# EAGLE design knitic v2.1 (EAGLE 7.2.0)
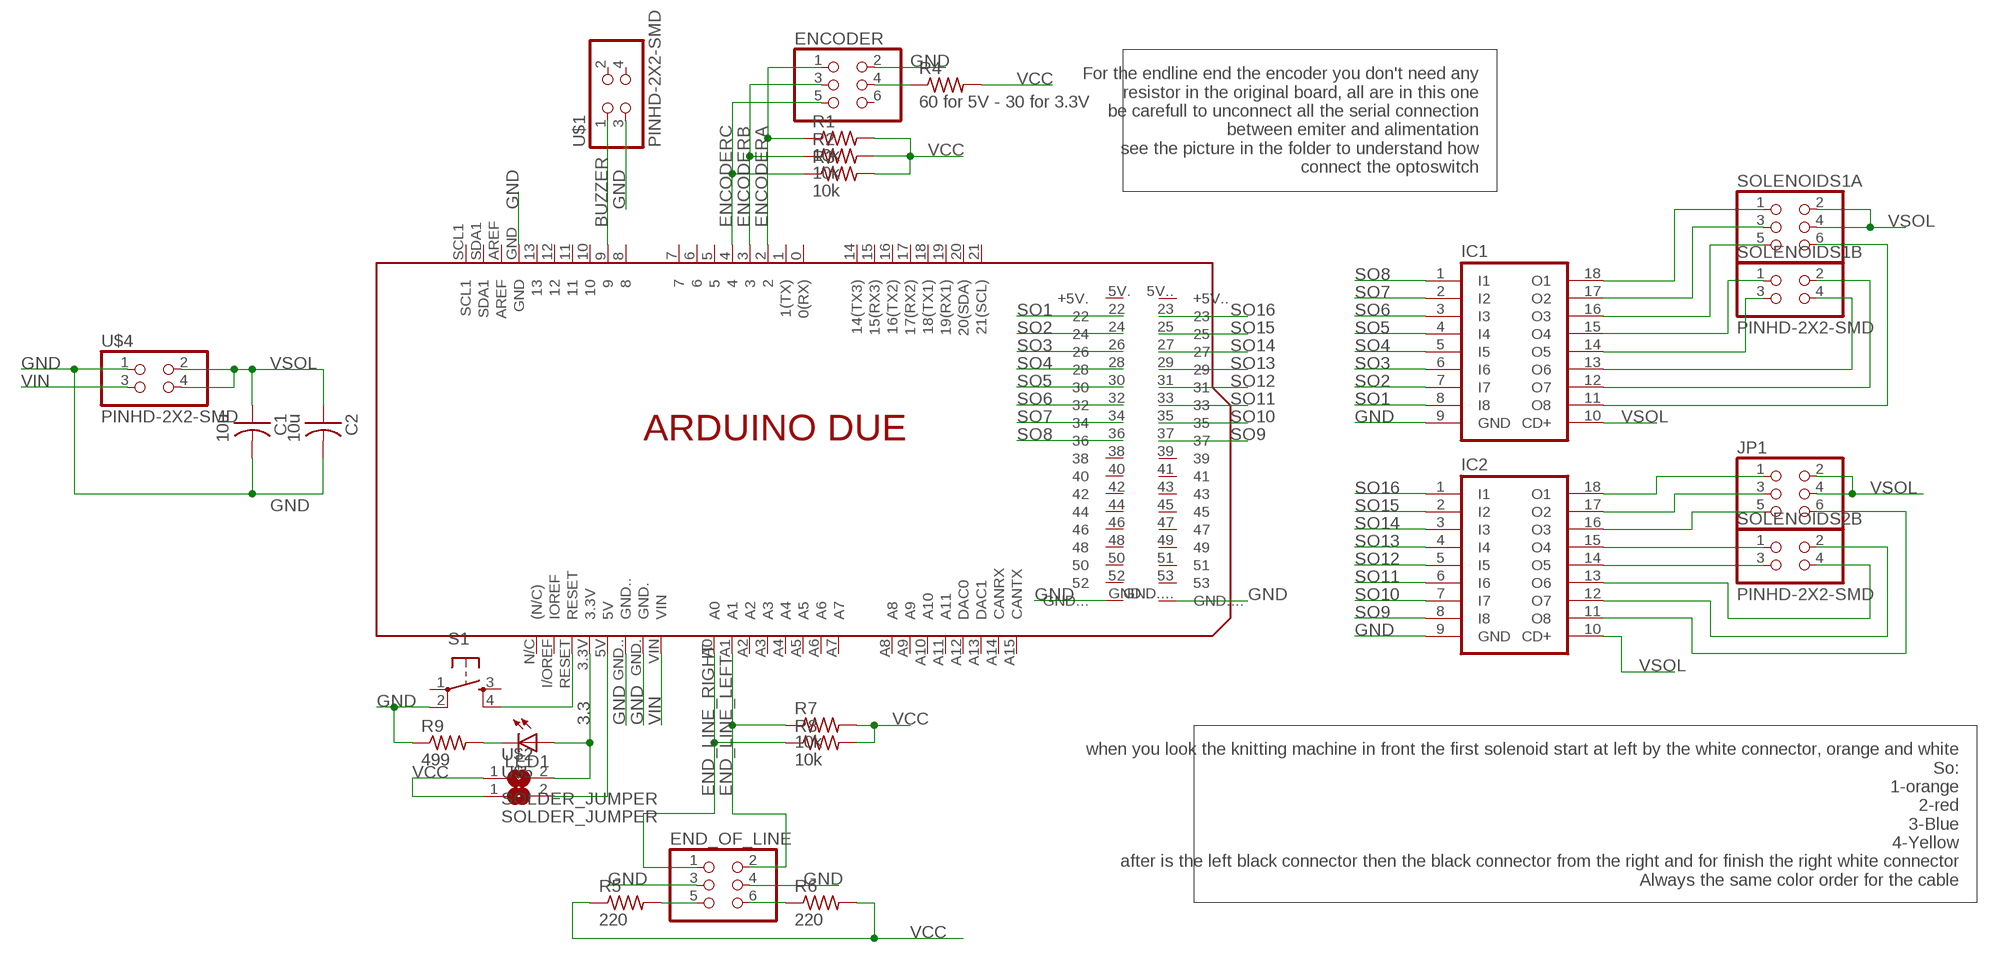
[diagram p0: schematic, sheet 1]

## Parts
C1  10u  CAP-US1206FAB  [C1206FAB]
C2  10u  CAP-US1206FAB  [C1206FAB]
ENCODER  PINHD-2X3-SMD  [2X03SMD]
END_OF_LINE  PINHD-2X3-SMD  [2X03SMD]
IC1  ULN2803ASO  [SO18W]
IC2  ULN2803ASO  [SO18W]
JP1  PINHD-2X3-SMD  [2X03SMD]
LED1  LEDSMT1206  [1206]
PCB1  ARDUINO_DUE_MIN  [ARDUINO_DUE_MIN]
R1  10k  RES-US1206FAB  [R1206FAB]
R2  10k  RES-US1206FAB  [R1206FAB]
R3  10k  RES-US1206FAB  [R1206FAB]
R4  60 for 5V - 30 for 3.3V  RES-US1206FAB  [R1206FAB]
R5  220  RES-US1206FAB  [R1206FAB]
R6  220  RES-US1206FAB  [R1206FAB]
R7  10k  RES-US1206FAB  [R1206FAB]
R8  10k  RES-US1206FAB  [R1206FAB]
R9  499  RES-US1206FAB  [R1206FAB]
S1  6MM_SWITCH6MM_SWITCH  [6MM_SWITCH]
SOLENOIDS1A  PINHD-2X3-SMD  [2X03SMD]
SOLENOIDS1B  PINHD-2X2-SMD  [2X02SMD]
SOLENOIDS2B  PINHD-2X2-SMD  [2X02SMD]
U$1  PINHD-2X2-SMD  [2X02SMD]
U$2  SOLDER_JUMPER  [SJFAB]
U$4  PINHD-2X2-SMD  [2X02SMD]
U$5  SOLDER_JUMPER  [SJFAB]

## Nets
3.3: LED1.A PCB1.3.3V U$2.2
BUZZER: PCB1.9 U$1.1
ENCODERA: ENCODER.1 PCB1.2 R1.1
ENCODERB: ENCODER.3 PCB1.3 R2.1
ENCODERC: ENCODER.5 PCB1.4 R3.1
END_LINE_LEFT: END_OF_LINE.2 PCB1.A1 R7.1
END_LINE_RIGHT: END_OF_LINE.1 PCB1.A0 R8.1
GND: C1.2 C2.2 ENCODER.2 END_OF_LINE.3 END_OF_LINE.4 IC1.9(GND) IC2.9(GND) PCB1.GND PCB1.GND. PCB1.GND.. R9.1 S1.2(P1) U$1.3 U$4.1
N$1: ENCODER.4 R4.1
N$2: END_OF_LINE.5 R5.2
N$3: PCB1.RESET S1.4(S1)
N$4: IC1.18(O1) SOLENOIDS1A.1
N$5: END_OF_LINE.6 R6.1
N$6: LED1.C R9.2
N$7: IC1.17(O2) SOLENOIDS1A.3
N$8: IC1.16(O3) SOLENOIDS1A.5
N$9: IC1.15(O4) SOLENOIDS1B.1
N$10: IC1.14(O5) SOLENOIDS1B.3
N$11: IC1.13(O6) SOLENOIDS1B.4
N$12: IC1.12(O7) SOLENOIDS1B.2
N$13: IC1.11(O8) SOLENOIDS1A.6
N$14: IC2.18(O1) JP1.1
N$15: IC2.12(O7) SOLENOIDS2B.2
N$17: IC2.17(O2) JP1.3
N$18: IC2.16(O3) JP1.5
N$19: IC2.13(O6) SOLENOIDS2B.4
N$20: IC2.15(O4) SOLENOIDS2B.1
N$21: IC2.11(O8) JP1.6
N$23: PCB1.5V U$5.2
N$24: IC2.14(O5) SOLENOIDS2B.3
SO1: IC1.8(I8) PCB1.22
SO2: IC1.7(I7) PCB1.24
SO3: IC1.6(I6) PCB1.26
SO4: IC1.5(I5) PCB1.28
SO5: IC1.4(I4) PCB1.30
SO6: IC1.3(I3) PCB1.32
SO7: IC1.2(I2) PCB1.34
SO8: IC1.1(I1) PCB1.36
SO9: IC2.8(I8) PCB1.37
SO10: IC2.7(I7) PCB1.35
SO11: IC2.6(I6) PCB1.33
SO12: IC2.5(I5) PCB1.31
SO13: IC2.4(I4) PCB1.29
SO14: IC2.3(I3) PCB1.27
SO15: IC2.2(I2) PCB1.25
SO16: IC2.1(I1) PCB1.23
VCC: R1.2 R2.2 R3.2 R4.2 R5.1 R6.2 R7.2 R8.2 U$2.1 U$5.1
VIN: PCB1.VIN U$4.3
VSOL: C1.1 C2.1 IC1.10(CD+) IC2.10(CD+) JP1.2 JP1.4 SOLENOIDS1A.2 SOLENOIDS1A.4 U$4.2 U$4.4
Unconnected: ENCODER.6 PCB1.0(0(RX)) PCB1.1(1(TX)) PCB1.5 PCB1.5V.(+5V.) PCB1.5V..(+5V..) PCB1.6 PCB1.7 PCB1.8 PCB1.10 PCB1.11 PCB1.12 PCB1.13 PCB1.14(14(TX3)) PCB1.15(15(RX3)) PCB1.16(16(TX2)) PCB1.17(17(RX2)) PCB1.18(18(TX1)) PCB1.19(19(RX1)) PCB1.20(20(SDA)) PCB1.21(21(SCL)) PCB1.38 PCB1.39 PCB1.40 PCB1.41 PCB1.42 PCB1.43 PCB1.44 PCB1.45 PCB1.46 PCB1.47 PCB1.48 PCB1.49 PCB1.50 PCB1.51 PCB1.52 PCB1.53 PCB1.A2 PCB1.A3 PCB1.A4 PCB1.A5 PCB1.A6 PCB1.A7 PCB1.A8 PCB1.A9 PCB1.A10 PCB1.A11 PCB1.A12(DAC0) PCB1.A13(DAC1) PCB1.A14(CANRX) PCB1.A15(CANTX) PCB1.AREF PCB1.GND... PCB1.GND.... PCB1.I/OREF(IOREF) PCB1.N/C((N/C)) PCB1.SCL1 PCB1.SDA1 S1.1(P) S1.3(S) U$1.2 U$1.4

## Notes on the sheet
- For the endline end the encoder you don't need any
  resistor in the original board, all are in this one
  be carefull to unconnect all the serial connection
  between emiter and alimentation
  see the picture in the folder to understand how
  connect the optoswitch
- when you look the knitting machine in front the first solenoid start at left by the white connector, orange and white
  So:
  1-orange
  2-red
  3-Blue
  4-Yellow
  after is the left black connector then the black connector from the right and for finish the right white connector
  Always the same color order for the cable

## Library data of the parts
C1 C2 = fab:CAP-US
ENCODER END_OF_LINE JP1 SOLENOIDS1A = fab:PINHD-2X3-SMD: PIN HEADER
IC1 IC2 = zoilo:ULN2803A: DRIVER ARRAY
LED1 = adafruit:LED: LED OSRAM: - CHIPLED LG R971, LG N971, LY N971, LG Q971, LY Q971, LO R971, LY R971 LH N974, LH R974 LS Q976, LO Q976, LY Q976 LO Q996 - Hyper CHIPLED LW Q18S LB Q993, LB Q99A, LB R99A - SideLED LS A670, LO A670, LY A670, LG A670, LP A670 LB A673, LV A673, LT A673, LW A673 LH A674 LY A675 LS A676, LA A676, LO A676, LY A676, LW A676 LS A679, LY A679, LG A679 - Hyper Micro SIDELED® LS Y876, LA Y876, LO Y876, LY Y876 LT Y87S - SmartLED LW L88C, LW L88S LB L89C, LB L89S, LG L890 LS L89K, LO L89K, LY L89K LS L896, LA L896, LO L896, LY L896 - TOPLED LS T670, LO T670, LY T670, LG T670, LP T670 LSG T670, LSP T670, LSY T670, LOP T670, LYG T670 LG T671, LOG T671, LSG T671 LB T673, LV T673, LT T673, LW T673 LH T674 LS T676, LA T676, LO T676, LY T676, LB T676, LH T676, LSB T676, LW T676 LB T67C, LV T67C, LT T67C, LS T67K, LO T67K, LY T67K, LW E67C LS E67B, LA E67B, LO E67B, LY E67B, LB E67C, LV E67C, LT E67C LW T67C LS T679, LY T679, LG T679 LS T770, LO T770, LY T770, LG T770, LP T770 LB T773, LV T773, LT T773, LW T773 LH T774 LS E675, LA E675, LY E675, LS T675 LS T776, LA T776, LO T776, LY T776, LB T776 LHGB T686 LT T68C, LB T68C - Hyper Mini TOPLED® LB M676 - Mini TOPLED Santana® LG M470 LS M47K, LO M47K, LY M47K Source: http://www.osram.convergy.de/
PCB1 = E14_Arduino_revB:ARDUINO_DUE_MIN
R1-R9 = fab:RES-US: Resistor (US Symbol) Variants with postfix FAB are widened to allow the routing of internal traces
S1 = fab:6MM_SWITCH: OMRON SWITCH
SOLENOIDS1B SOLENOIDS2B U$1 U$4 = fab:PINHD-2X2-SMD
U$2 U$5 = fab:SOLDER_JUMPER

## Board
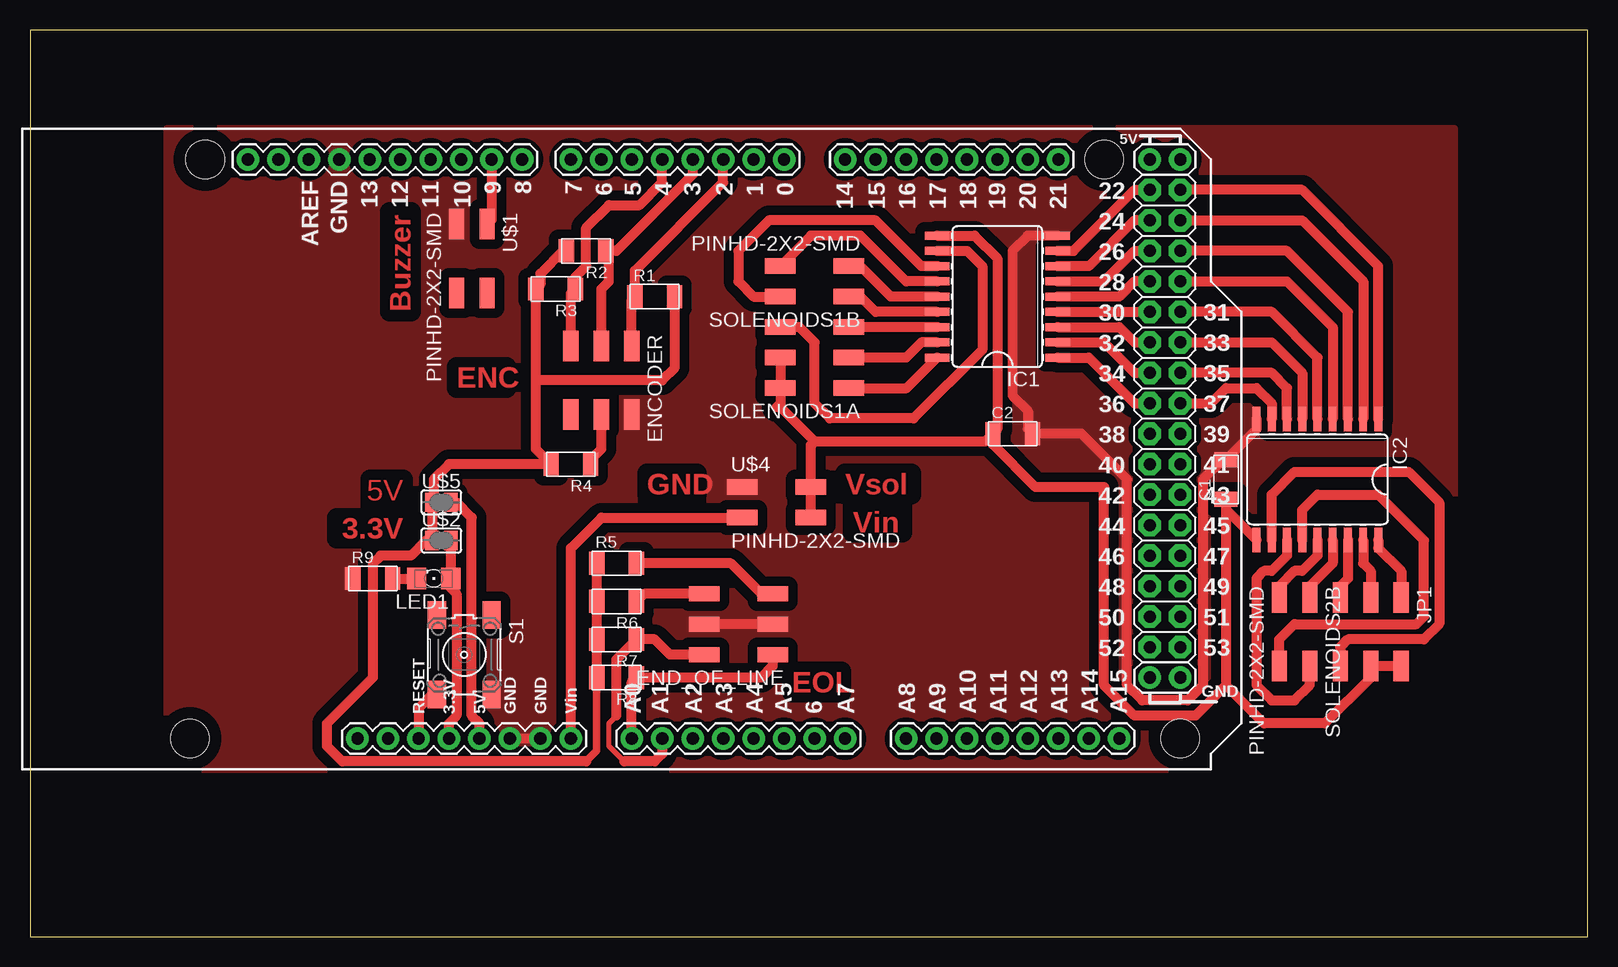
[diagram p1: board, top side]

Size 129.84 x 75.55 mm. Coordinates in mm from the lower left corner, seen from the top.
Outline: 0,0 129.84,0 129.84,75.55 0,75.55 0,0
Copper layers (1*16): Top 0.035mm / dielectric 1.5mm / Bottom 0.035mm
Design rules "fabmodule": minimum track width 10mil, minimum drill 0.4mm, track to track 0.42mm, track to pad 0.42mm, pad to pad 0.42mm, via to via 0.42mm, smd to smd 0.42mm, copper to edge 40mil, drill to drill 0.8mm, minimum pad ring 10mil, minimum via ring 8mil, stop-mask expansion 4mil, vias tented up to drill 0mil, thermal gap 10mil

### Footprints (pad centres in the part's own frame; a part is rotated, then mirrored left to right if it is on the bottom)
C1206FAB = smd 1.27 x 1.905: 1 -1.651,0; 2 1.651,0
2X03SMD = smd 2.54 x 1.27: 1 -2.857,2.54; 2 2.857,2.54; 3 -2.857,0; 4 2.857,0; 5 -2.857,-2.54; 6 2.857,-2.54
SO18W = smd 0.66 x 2.032: 1 -5.08,-5.029; 2 -3.81,-5.029; 3 -2.54,-5.029; 4 -1.27,-5.029; 5 0,-5.029; 6 1.27,-5.029; 7 2.54,-5.029; 8 3.81,-5.029; 9 5.08,-5.029; 10 5.08,5.029; 11 3.81,5.029; 12 2.54,5.029; 13 1.27,5.029; 14 0,5.029; 15 -1.27,5.029; 16 -2.54,5.029; 17 -3.81,5.029; 18 -5.08,5.029
1206 = smd 1.6 x 1.803: A -1.422,0; C 1.422,0
ARDUINO_DUE_MIN = drill 1.016 pad 1.88: 0 35.56,24.13; 1 33.02,24.13; 2 30.48,24.13; 3 27.94,24.13; 3.3V 7.62,-24.13; 4 25.4,24.13; 5 22.86,24.13; 5V 10.16,-24.13; 5V. 66.04,24.13; 5V.. 68.58,24.13; 6 20.32,24.13; 7 17.78,24.13; 8 13.716,24.13; 9 11.176,24.13; 10 8.636,24.13; 11 6.096,24.13; 12 3.556,24.13; 13 1.016,24.13; 14 40.64,24.13; 15 43.18,24.13; 16 45.72,24.13; 17 48.26,24.13; 18 50.8,24.13; 19 53.34,24.13; 20 55.88,24.13; 21 58.42,24.13; A0 22.86,-24.13; A1 25.4,-24.13; A2 27.94,-24.13; A3 30.48,-24.13; A4 33.02,-24.13; A5 35.56,-24.13; A6 38.1,-24.13; A7 40.64,-24.13; A8 45.72,-24.13; A9 48.26,-24.13; A10 50.8,-24.13; A11 53.34,-24.13; A12 55.88,-24.13; A13 58.42,-24.13; A14 60.96,-24.13; A15 63.5,-24.13; AREF -4.064,24.13; GND -1.524,24.13; GND. 15.24,-24.13; GND.. 12.7,-24.13; GND... 66.04,-19.05; GND.... 68.58,-19.05; I/OREF 2.54,-24.13; N/C 0,-24.13; RESET 5.08,-24.13; SCL1 -9.144,24.13; SDA1 -6.604,24.13; VIN 17.78,-24.13 | drill 1.016 pad 1.88 octagon: 22 66.04,21.59; 23 68.58,21.59; 24 66.04,19.05; 25 68.58,19.05; 26 66.04,16.51; 27 68.58,16.51; 28 66.04,13.97; 29 68.58,13.97; 30 66.04,11.43; 31 68.58,11.43; 32 66.04,8.89; 33 68.58,8.89; 34 66.04,6.35; 35 68.58,6.35; 36 66.04,3.81; 37 68.58,3.81; 38 66.04,1.27; 39 68.58,1.27; 40 66.04,-1.27; 41 68.58,-1.27; 42 66.04,-3.81; 43 68.58,-3.81; 44 66.04,-6.35; 45 68.58,-6.35; 46 66.04,-8.89; 47 68.58,-8.89; 48 66.04,-11.43; 49 68.58,-11.43; 50 66.04,-13.97; 51 68.58,-13.97; 52 66.04,-16.51; 53 68.58,-16.51 | hole 3.2: -12.7,24.13; -13.97,-24.13; 62.23,24.13; 68.58,-24.13
R1206FAB = smd 1.27 x 1.905: 1 -1.651,0; 2 1.651,0
6MM_SWITCH = smd 2.286 x 1.524: 1 -3.302,2.286; 2 3.302,2.286; 3 -3.302,-2.286; 4 3.302,-2.286
2X02SMD = smd 2.54 x 1.27: 1 -2.857,1.27; 2 2.857,1.27; 3 -2.857,-1.27; 4 2.857,-1.27
SJFAB = smd 1.118 x 1.6: 1 -0.787,0; 2 0.787,0

### Placement (x,y rotation side)
C1  99.69,38.1 90 top
C2  81.91,41.91 0 top
ENCODER  47.62,46.36 270 top
END_OF_LINE  59.05,26.04 180 top
IC1  80.65,53.34 90 top
IC2  107.31,38.1 180 top
JP1  111.76,25.4 270 top
LED1  33.66,29.84 180 top
PCB1  27.3,40.64 0 top
R1  52.07,53.34 0 top
R2  46.36,57.15 180 top
R3  43.81,53.97 180 top
R4  45.09,39.37 180 top
R5  48.9,31.11 0 top
R6  48.9,27.94 180 top
R7  48.9,24.77 180 top
R8  48.9,21.59 180 top
R9  28.58,29.84 0 top
S1  36.2,23.5 270 top
SOLENOIDS1A  65.41,48.26 180 top
SOLENOIDS1B  65.41,54.61 180 top
SOLENOIDS2B  105.41,25.4 270 top
U$1  36.83,56.52 270 top
U$2  34.29,33.02 0 top
U$4  62.23,36.2 0 top
U$5  34.29,36.2 0 top

### Tracks (layer width: path | path; a pad name or v marks a point on that pad's centre or on a via)
3.3
  Top 0.813: PCB1.3.3V 34.92,17.78 35.56,18.41 35.56,28.57 35.08,29.06 LED1.A | U$2.2 LED1.A | LED1.A
BUZZER
  Top 0.813: PCB1.9 38.48,59.75 U$1.1
ENCODERA
  Top 0.813: ENCODER.1 50.16,53.09 R1.1 50.42,55.5 57.79,62.86 PCB1.2
ENCODERB
  Top 0.813: PCB1.3 55.24,63.5 48.9,57.15 R2.1 48.26,56.9 48.26,54.61 47.62,53.97 ENCODER.3
ENCODERC
  Top 0.813: ENCODER.5 45.09,53.59 R3.1 45.47,54.99 46.36,55.88 46.36,59.06 48.26,60.96 50.8,60.96 52.7,62.86 PCB1.4
END_LINE_LEFT
  Top 0.406: 49.53,14.61 48.26,15.88 48.26,17.78 48.9,18.41
  Top 0.813: END_OF_LINE.2 53.34,23.5 52.07,24.77 R7.1 48.9,23.11 48.9,18.41 | PCB1.A1 52.7,15.24 52.07,14.61 49.53,14.61
END_LINE_RIGHT
  Top 0.813: PCB1.A0 50.16,21.21 R8.1 60.96,21.59 61.91,22.54 END_OF_LINE.1
GND
  Top 0.813: IC2.9 102.24,42.29 C1.2 99.44,39.75 97.79,38.1 97.79,20.95 96.52,19.69 92.71,19.69 91.44,20.95 91.44,38.1 87.63,41.91 C2.2 83.19,42.29 83.19,43.81 81.91,45.08 81.91,57.15 83.19,58.42 IC1.9 | END_OF_LINE.3 END_OF_LINE.4 | PCB1.GND. PCB1.GND..
  pour Top (isolate 0.813, no thermals): 11.43,67.31 118.75,67.31 118.75,13.97 11.43,13.97
N$1
  Top 0.813: R4.1 46.74,39.75 47.62,40.64 ENCODER.4
N$2
  Top 0.813: END_OF_LINE.5 60.96,28.57 58.42,31.11 R5.2
N$3
  Top 0.813: S1.4 33.53,20.19 32.39,19.05 PCB1.RESET
N$4
  Top 0.813: SOLENOIDS1A.1 73.08,45.72 IC1.18
N$5
  Top 0.813: END_OF_LINE.6 51.18,28.57 R6.1
N$6
  Top 0.813: R9.2 LED1.C
N$7
  Top 0.813: IC1.17 74.3,49.53 73.03,48.26 SOLENOIDS1A.3
N$8
  Top 0.813: IC1.16 SOLENOIDS1A.5
N$9
  Top 0.813: IC1.15 70.48,52.07 69.22,53.34 SOLENOIDS1B.1
N$10
  Top 0.813: IC1.14 71.75,53.34 69.22,55.88 SOLENOIDS1B.3
N$11
  Top 0.813: IC1.13 73.03,54.61 69.22,58.42 65.09,58.42 SOLENOIDS1B.4
N$12
  Top 0.813: IC1.12 74.3,55.88 70.48,59.69 61.59,59.69 59.05,57.15 59.05,54.61 60.33,53.34 SOLENOIDS1B.2
N$13
  Top 0.813: IC1.11 78.1,57.15 79.38,55.88 79.38,48.89 73.66,43.18 66.68,43.18 65.41,44.45 65.41,49.53 64.13,50.8 SOLENOIDS1A.6
N$14
  Top 0.813: IC2.18 112.4,32.39 114.3,30.48 JP1.1
N$15
  Top 0.813: IC2.12 104.78,31.75 103.5,30.48 102.87,30.48 102.24,29.84 102.24,20.95 103.5,19.69 105.41,19.69 106.68,20.95 SOLENOIDS2B.2
N$17
  Top 0.813: IC2.17 111.12,31.11 111.76,30.48 JP1.3
N$18
  Top 0.813: IC2.16 109.85,29.84 109.22,29.21 JP1.5
N$19
  Top 0.813: IC2.13 106.04,35.56 107.31,36.83 112.4,36.83 116.21,33.02 116.21,26.67 115.57,26.04 105.41,26.04 104.14,24.77 SOLENOIDS2B.4
N$20
  Top 0.813: IC2.15 108.59,31.11 106.68,29.21 SOLENOIDS2B.1
N$21
  Top 0.813: IC2.11 103.5,36.83 105.41,38.73 114.94,38.73 117.47,36.2 117.47,26.04 116.21,24.77 109.85,24.77 109.22,24.13 JP1.6
N$23
  Top 0.813: PCB1.5V 37.47,17.78 36.83,18.41 36.83,34.92 35.56,36.2 U$5.2
N$24
  Top 0.813: IC2.14 107.31,31.75 106.04,30.48 105.41,30.48 104.14,29.21 SOLENOIDS2B.3
SO1
  Top 0.813: IC1.8 87,57.15 92.07,62.23 PCB1.22
SO2
  Top 0.813: PCB1.24 92.07,59.69 88.27,55.88 IC1.7
SO3
  Top 0.813: IC1.6 89.53,54.61 92.07,57.15 PCB1.26
SO4
  Top 0.813: PCB1.28 92.07,54.61 90.81,53.34 IC1.5
SO5
  Top 0.813: IC1.4 PCB1.30
SO6
  Top 0.813: IC1.3 90.81,50.8 92.07,49.53 PCB1.32
SO7
  Top 0.813: IC1.2 89.53,49.53 92.07,46.99 PCB1.34
SO8
  Top 0.813: IC1.1 88.27,48.26 92.07,44.45 PCB1.36
SO9
  Top 0.813: PCB1.37 98.43,44.45 99.69,45.72 102.24,45.72 103.5,44.45 IC2.8
SO10
  Top 0.813: IC2.7 104.78,45.72 103.5,46.99 PCB1.35
SO11
  Top 0.813: PCB1.33 103.5,49.53 106.04,46.99 IC2.6
SO12
  Top 0.813: IC2.5 107.31,48.26 103.5,52.07 PCB1.31
SO13
  Top 0.813: PCB1.29 104.78,54.61 108.59,50.8 IC2.4
SO14
  Top 0.813: IC2.3 109.85,52.07 104.78,57.15 PCB1.27
SO15
  Top 0.813: PCB1.25 106.04,59.69 111.12,54.61 IC2.2
SO16
  Top 0.813: IC2.1 112.4,55.88 106.04,62.23 PCB1.23
VCC
  Top 0.61: R8.2 47.24,15.49 46.36,14.61
  Top 0.813: R5.1 R6.2 R7.2 R8.2 | 46.36,14.61 26.04,14.61 24.77,15.88 24.77,17.78 28.58,21.59 28.58,31.11 29.21,31.75 31.75,31.75 33.02,33.02 U$2.1 U$5.1 33.66,36.35 33.66,38.1 34.92,39.37 R4.2 42.16,40.64 42.16,46.36 | 42.16,46.36 R3.2 42.55,54.36 42.55,55.25 44.45,57.15 R2.2 | R1.2 53.72,47.37 52.7,46.36 42.16,46.36
VIN
  Top 0.813: PCB1.VIN 45.09,32.39 47.62,34.92 U$4.3
VSOL
  Top 0.813: SOLENOIDS1A.4 SOLENOIDS1A.2 62.55,44.45 | IC2.10 99.69,35.61 C1.1 99.69,20.95 | 99.69,20.95 97.16,18.41 92.07,18.41 89.53,20.95 89.53,37.47 83.82,37.47 80.26,41.02 C2.1 | 62.55,44.45 62.55,44.13 65.41,41.27 | 62.23,44.13 62.55,44.45 | IC1.10 78.74,58.42 80.65,56.52 80.65,42.29 C2.1 | U$4.4 U$4.2 65.09,40.96 65.41,41.27 | JP1.2 JP1.4 111.76,21.59 107.95,17.78 102.87,17.78 99.69,20.95 | 65.41,41.27 79.63,41.27 C2.1

### Text on the board
Top: Buzzer | ENC | 5V | GND | Vsol | 3.3V | Vin | EOL